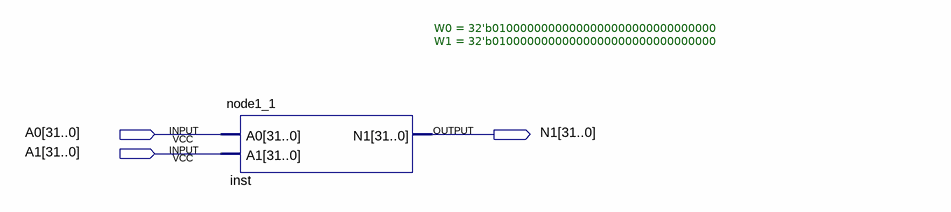
[diagram p0: schematic sheet]
// Quartus schematic neural_net_top.bdf as structural Verilog: 1 symbols, 3 pins
module neural_net_top (
  input  [31:0] A0,
  input  [31:0] A1,
  output [31:0] N1
);

  node1_1 #(.W0(32'b01000000000000000000000000000000), .W1(32'b01000000000000000000000000000000)) inst (
    .A0(A0), .A1(A1), .N1(N1));
endmodule
